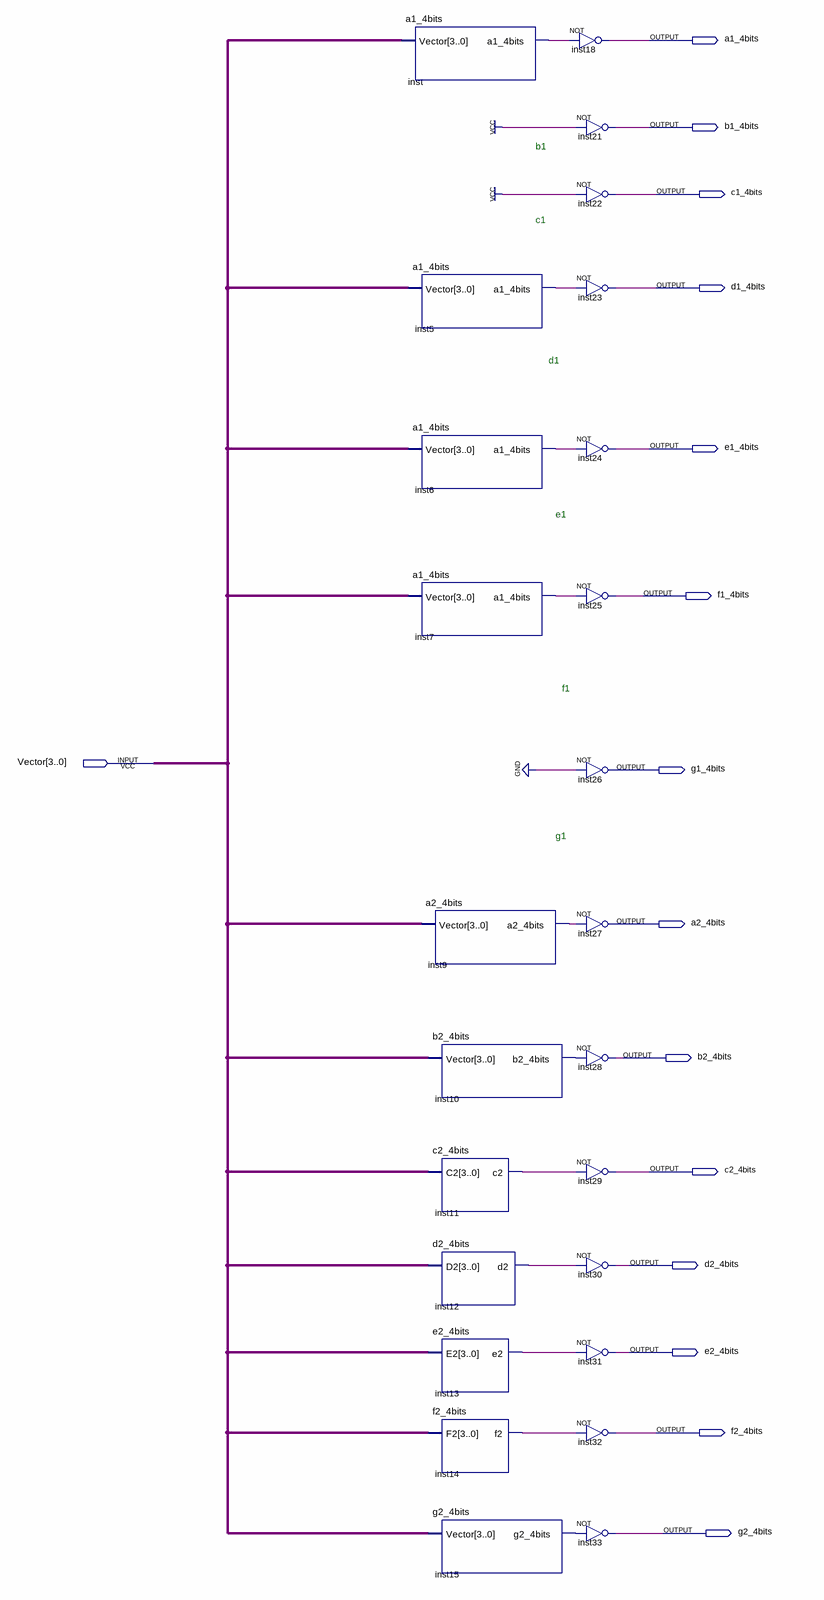
[diagram p0: schematic sheet]
// Quartus schematic decodificador_nerfado.bdf as structural Verilog: 25 symbols, 15 pins
module decodificador_nerfado (
  input  [3:0] Vector,
  output a1_4bits,
  output b1_4bits,
  output c1_4bits,
  output d1_4bits,
  output e1_4bits,
  output f1_4bits,
  output g1_4bits,
  output a2_4bits,
  output b2_4bits,
  output c2_4bits,
  output d2_4bits,
  output e2_4bits,
  output f2_4bits,
  output g2_4bits
);

  wire inst5_a1_4bits, inst6_a1_4bits, inst7_a1_4bits, inst9_a2_4bits, inst10_b2_4bits, inst11_c2, inst12_d2,
       inst13_e2, inst14_f2, inst15_g2_4bits, inst_a1_4bits;

  a1_4bits inst (.Vector(Vector), .a1_4bits(inst_a1_4bits));
  a1_4bits inst5 (.Vector(Vector), .a1_4bits(inst5_a1_4bits));
  a1_4bits inst6 (.Vector(Vector), .a1_4bits(inst6_a1_4bits));
  a1_4bits inst7 (.Vector(Vector), .a1_4bits(inst7_a1_4bits));
  a2_4bits inst9 (.Vector(Vector), .a2_4bits(inst9_a2_4bits));
  b2_4bits inst10 (.Vector(Vector), .b2_4bits(inst10_b2_4bits));
  c2_4bits inst11 (.C2(Vector), .c2(inst11_c2));
  d2_4bits inst12 (.D2(Vector), .d2(inst12_d2));
  e2_4bits inst13 (.E2(Vector), .e2(inst13_e2));
  f2_4bits inst14 (.F2(Vector), .f2(inst14_f2));
  g2_4bits inst15 (.Vector(Vector), .g2_4bits(inst15_g2_4bits));
  not inst18 (a1_4bits, inst_a1_4bits);
  not inst21 (b1_4bits, 1'b1);
  not inst22 (c1_4bits, 1'b1);
  not inst23 (d1_4bits, inst5_a1_4bits);
  not inst24 (e1_4bits, inst6_a1_4bits);
  not inst25 (f1_4bits, inst7_a1_4bits);
  not inst26 (g1_4bits, 1'b0);
  not inst27 (a2_4bits, inst9_a2_4bits);
  not inst28 (b2_4bits, inst10_b2_4bits);
  not inst29 (c2_4bits, inst11_c2);
  not inst30 (d2_4bits, inst12_d2);
  not inst31 (e2_4bits, inst13_e2);
  not inst32 (f2_4bits, inst14_f2);
  not inst33 (g2_4bits, inst15_g2_4bits);

  // Notes on the sheet:
  //   b1
  //   c1
  //   d1
  //   e1
  //   f1
  //   g1
endmodule
